# Altium schematic sheet 对射光电IC款UM8004-20260108.SchDoc
size 812 x 381 mm; SheetNumber: 0; SheetTotal: 0
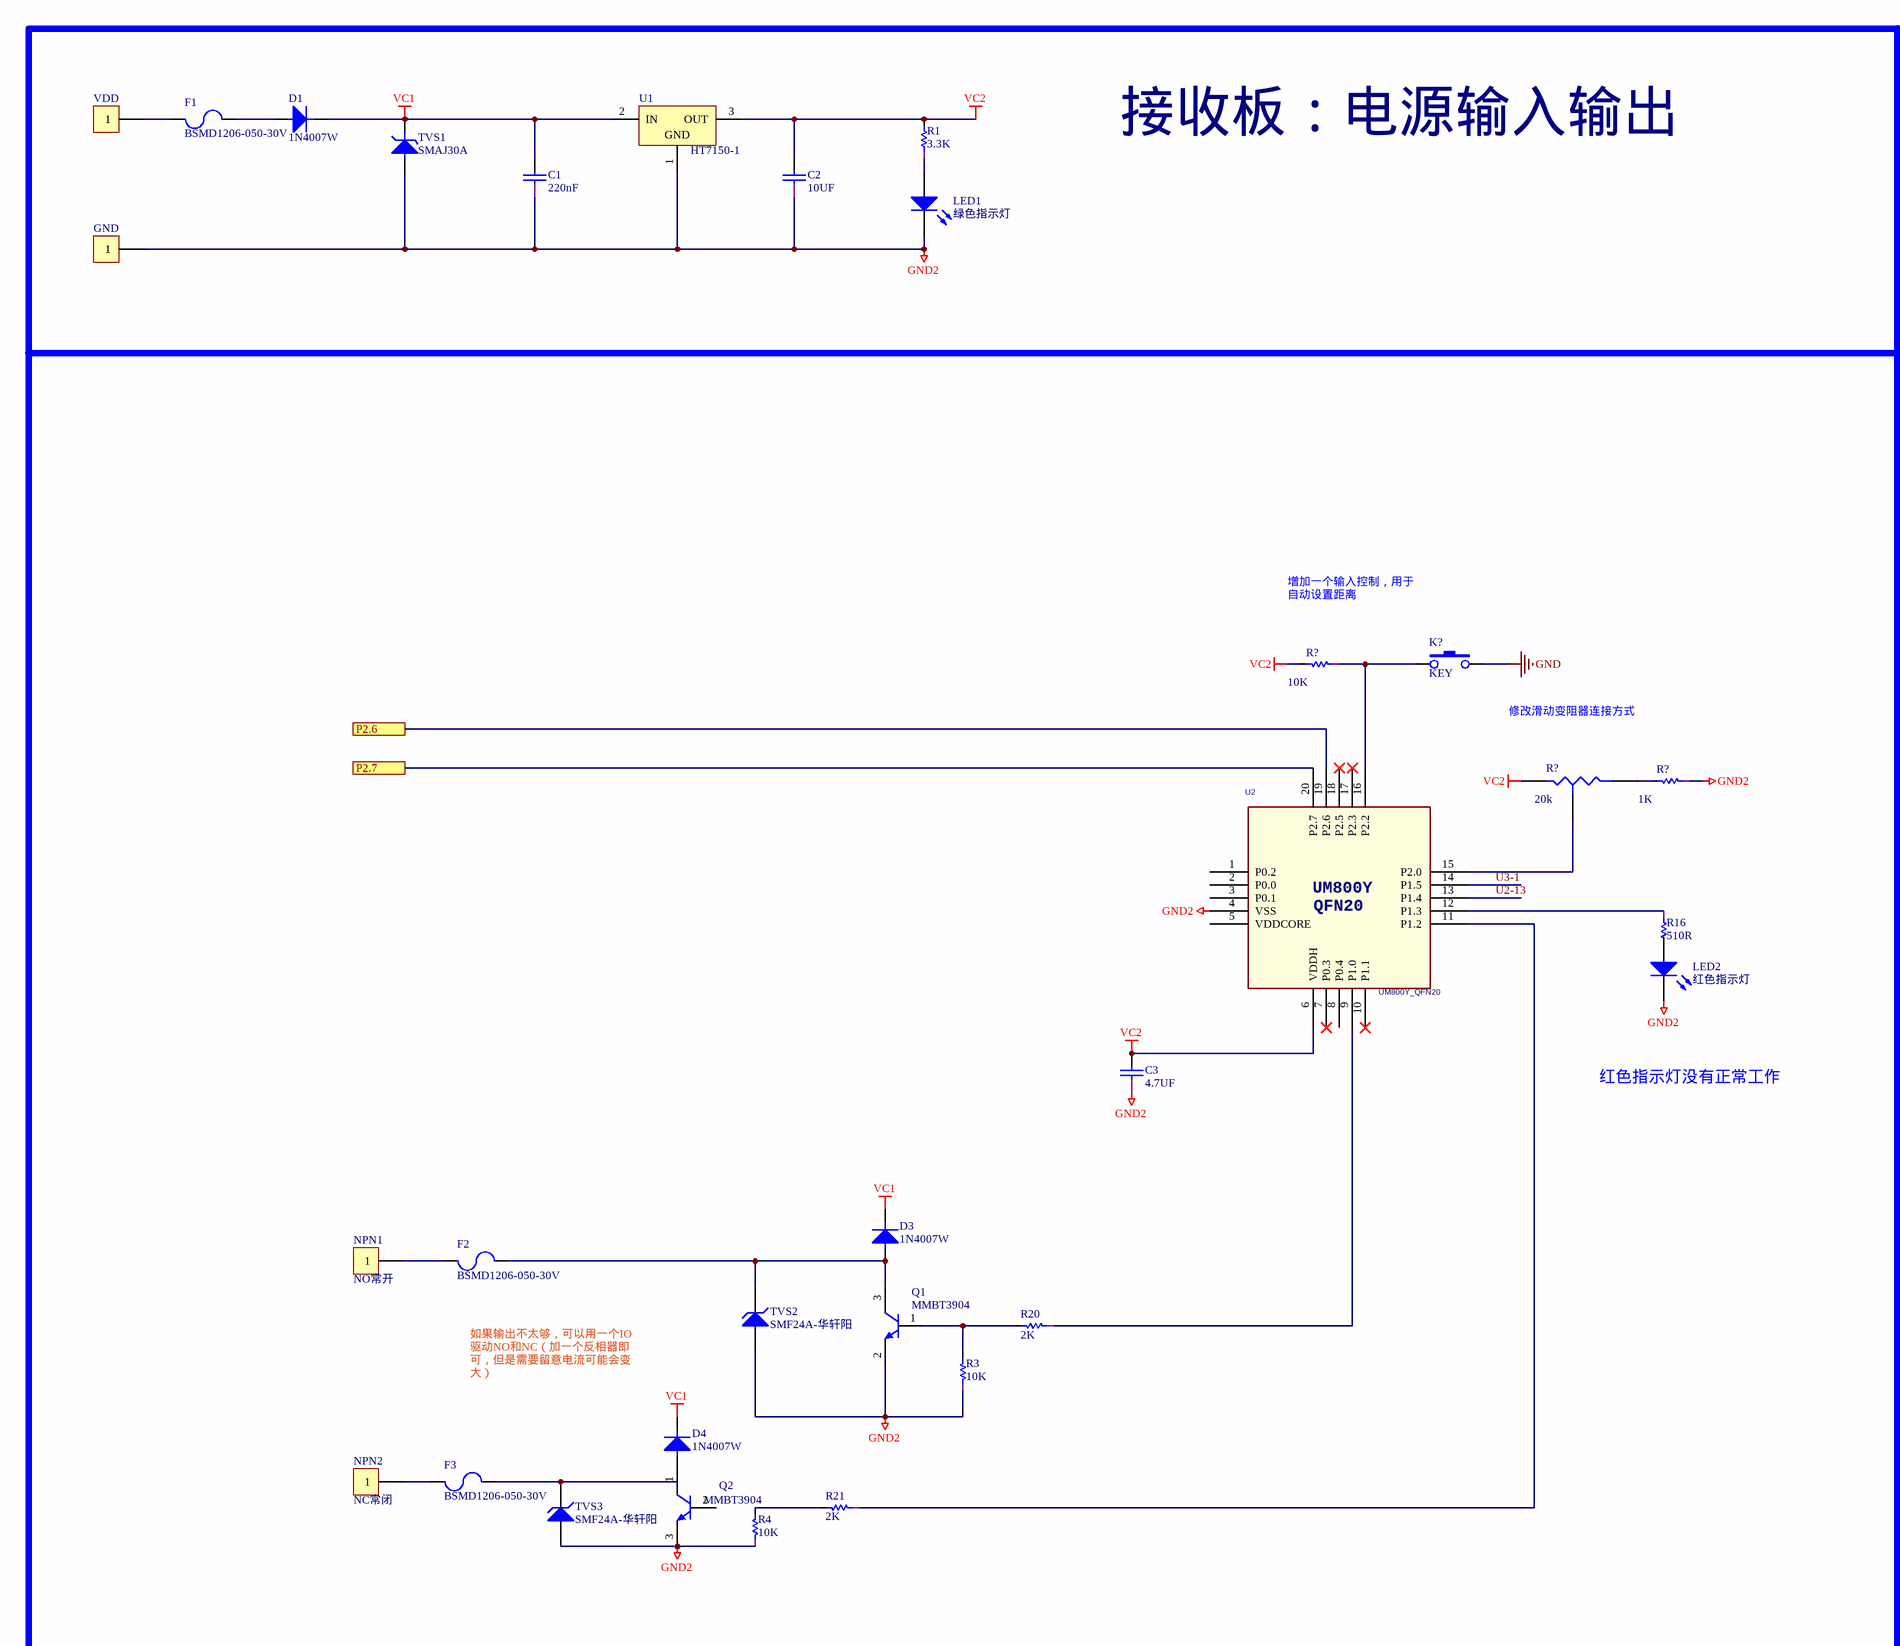
[diagram p0: 对射光电IC款UM8004-20260108.SchDoc, left]
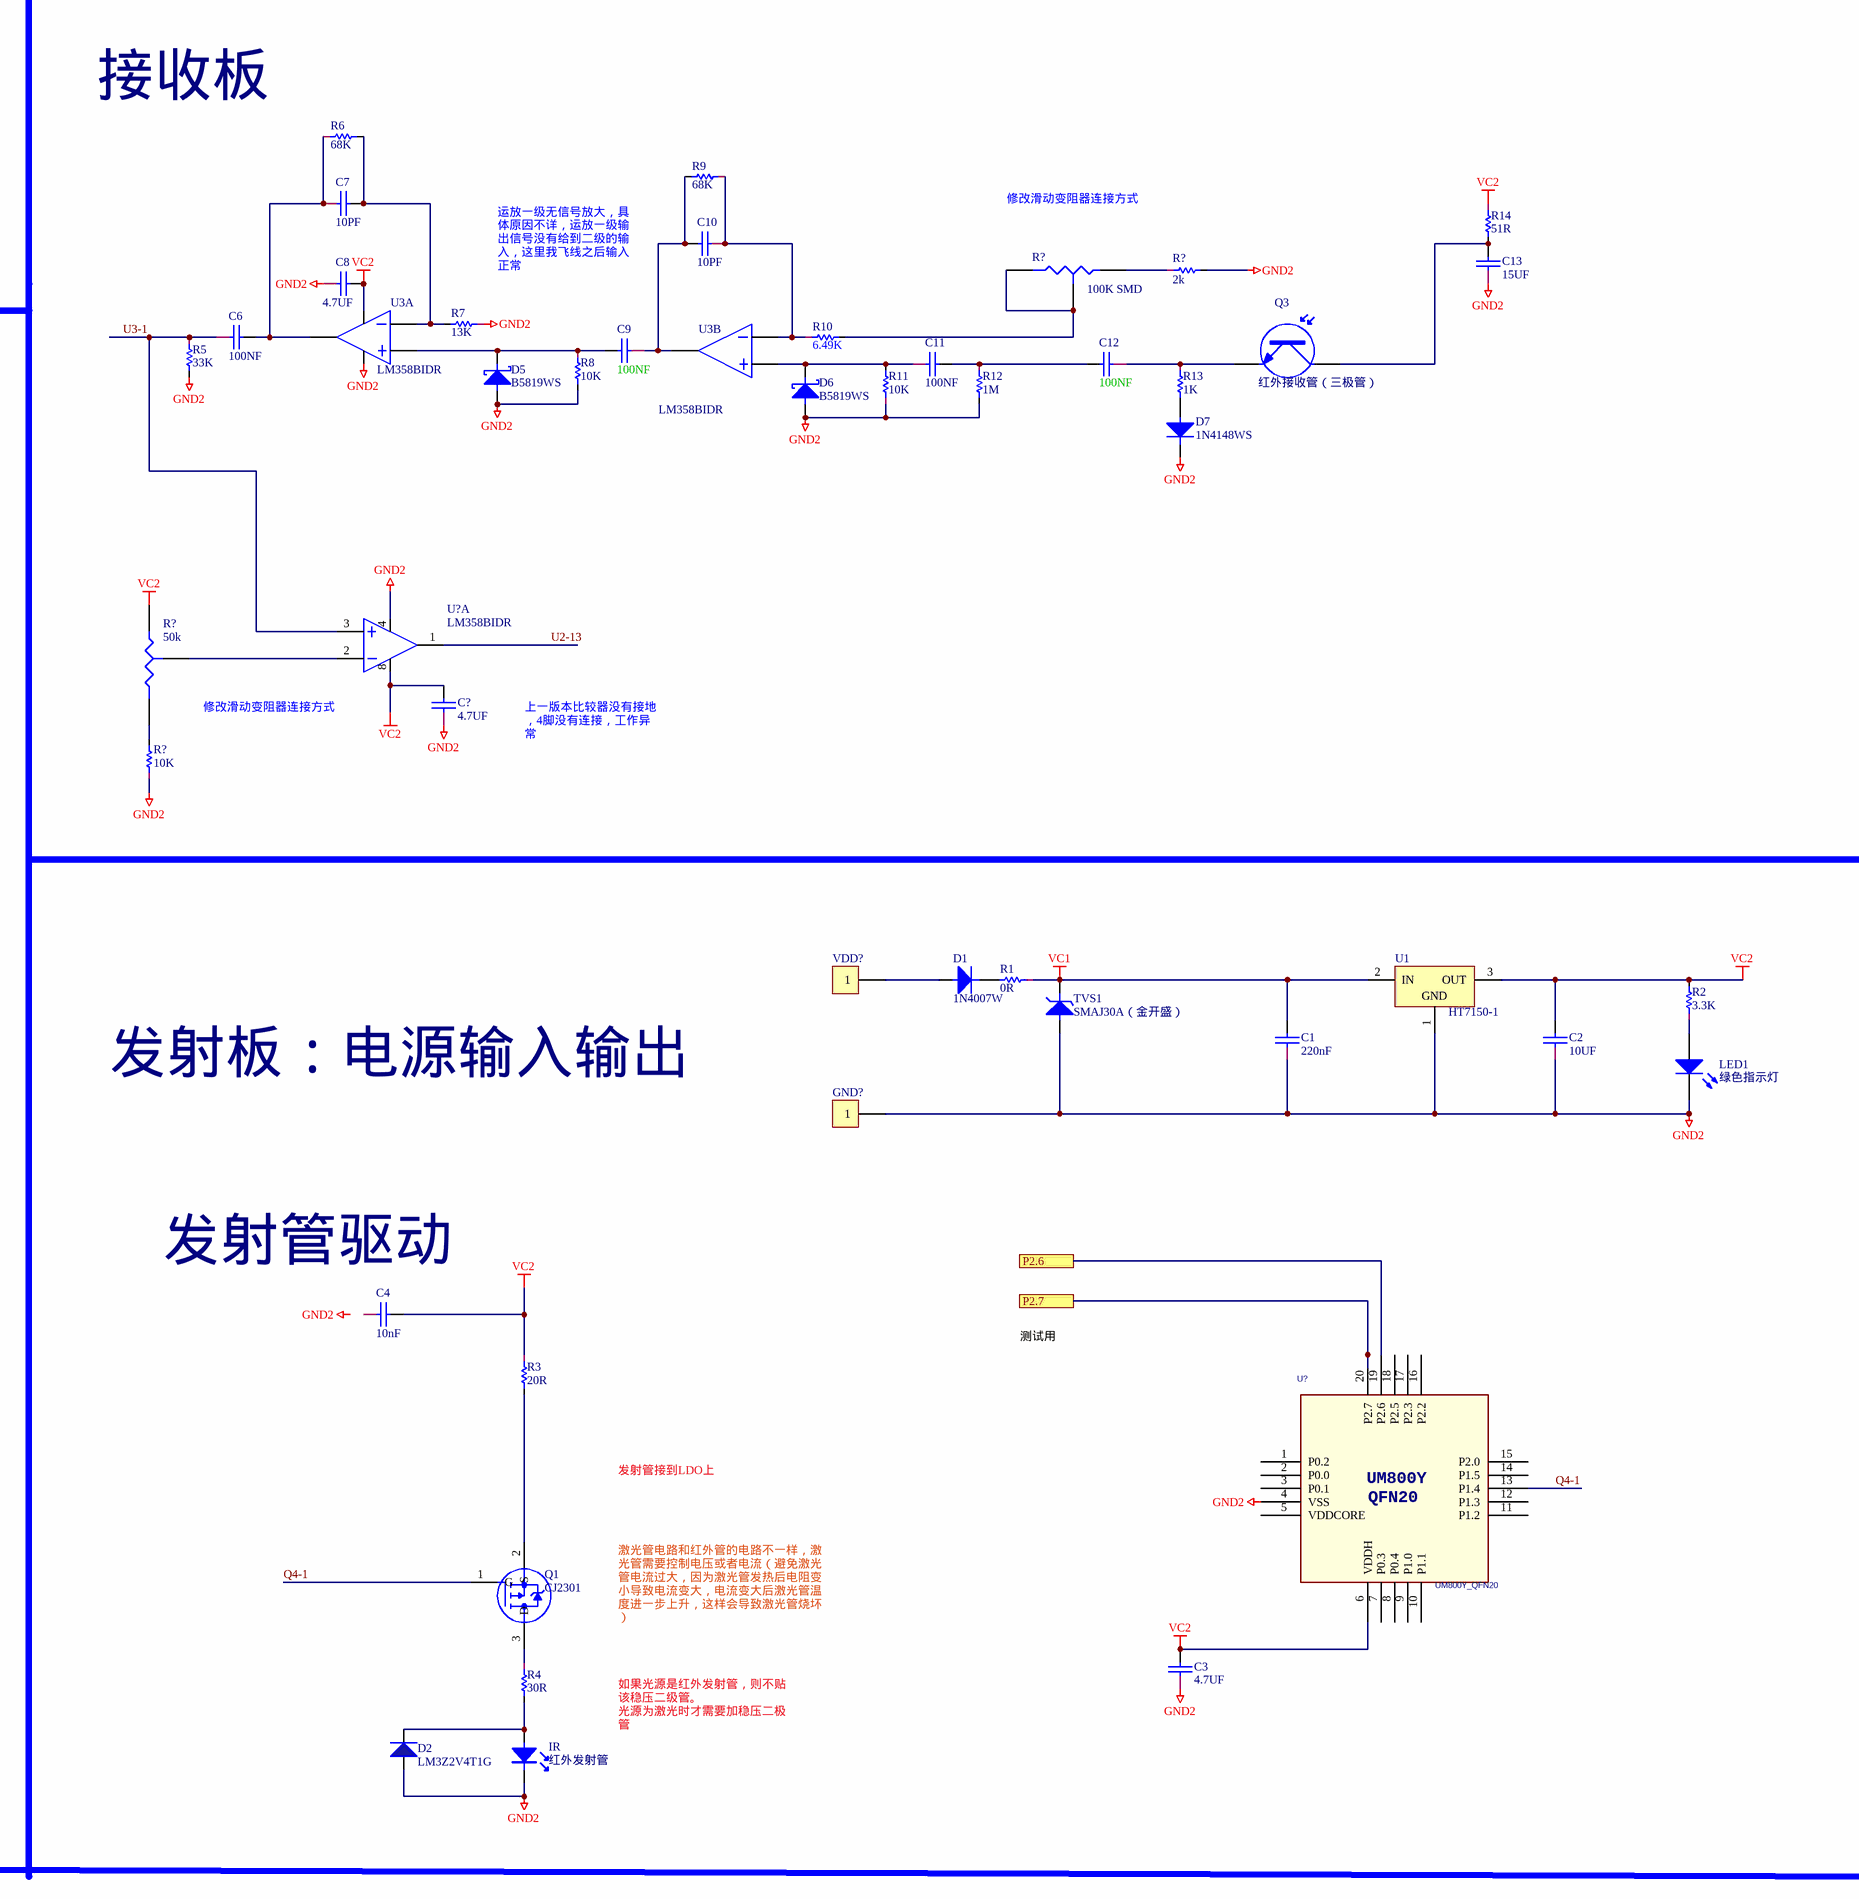
[diagram p1: 对射光电IC款UM8004-20260108.SchDoc, right]

## Parts
(Parts that share a designator on the sheet are numbered #1, #2 ... from top to bottom, then left to right.)
C1#1  220nF  [0603A]
C1#2  220nF  [0603A]
C2#1  10UF  [0603A]
C2#2  10UF  [0603A]
C3#1  4.7UF  [0603A]
C3#2  4.7UF  [0603A]
C4  10nF  [0603A]
C6  100NF  [0603A]
C7  10PF  [0603A]
C8  4.7UF  [0603A]
C9  100NF  [0603A]
C10  10PF  [0603A]
C11  100NF  [0603A]
C12  100NF  [0603A]
C13  15UF  [L]
C?  4.7UF  [0603A]
D1#1  1N4007W  [D1]
D1#2  1N4007W  [D1]
D2  LM3Z2V4T1G
D3  1N4007W  [D1]
D4  1N4007W  [D1]
D5  B5819WS  [D]
D6  B5819WS  [D]
D7  1N4148WS  [D]
F1  BSMD1206-050-30V  [1206]
F2  BSMD1206-050-30V  [1206]
F3  BSMD1206-050-30V  [1206]
GND  (no value)  [P]
GND?  (no value)  [P]
IR  红外发射管  [D4]
K?  KEY  [DIP-3X6X4.3]
LED1#1  绿色指示灯  [3.2X1.6X1.1]
LED1#2  绿色指示灯  [3.2X1.6X1.1]
LED2  红色指示灯  [3.2X1.6X1.1]
NPN1  NO常开  [P]
NPN2  NC常闭  [P]
Q1#1  MMBT3904  [TO-226-AA]
Q1#2  CJ2301  [SOP-3D]
Q2  MMBT3904  [TO-226-AA]
Q3  红外接收管（三极管）  [TO-220_A]
R1#1  3.3K  [0603]
R1#2  0R  [2512]
R2  3.3K  [0603]
R3#1  10K  [0603]
R3#2  20R  [0603]
R4#1  10K  [0603]
R4#2  30R  [0603]
R5  33K  [0603]
R6  68K  [0603]
R7  13K  [0603]
R8  10K  [0603]
R9  68K  [0603]
R10  6.49K  [0603]
R11  10K  [0603]
R12  1M  [0603]
R13  1K  [0603]
R14  51R  [1206]
R16  510R  [0603]
R20  2K  [0603]
R21  2K  [0603]
R?#1  value 100K SMD  [VR3]  (hidden comment: Res Tap)
R?#2  2k  [0603]
R?#3  value 50k  [VR3]  (hidden comment: Res Tap)
R?#4  10K  [0603]
R?#5  10K  [0603]
R?#6  value 20k  [VR3]  (hidden comment: Res Tap)
R?#7  1K  [0603]
TVS1#1  SMAJ30A  [D2]
TVS1#2  SMAJ30A（金开盛）  [D2]
TVS2  SMF24A-华轩阳  [GLZZ0002ZA-A]
TVS3  SMF24A-华轩阳  [GLZZ0002ZA-A]
U1#1  HT7150-1  [SOT89N]
U1#2  HT7150-1  [SOT89N]
U2  UM800Y_QFN20  [QFN20_300X300X55E40]
U3  LM358BIDR  [SOP-8]  (parts A,B of 2)
U?#1  LM358BIDR  [SOP-8]  (part A of 2)
U?#2  UM800Y_QFN20  [QFN20_300X300X55E40]
VDD  (no value)  [P]
VDD?  (no value)  [P]

## Ports
P2.6, P2.7

## Nets
GND: K?.3
GND2: C1#1.2 C1#2.2 C2#1.2 C2#2.2 C3#1.2 C3#2.2 C8.2 C13.2 C?.2 D2.1 D5.1 D6.1 D7.1(K) GND.1 GND?.1 IR.1 LED1#1.2(K) LED1#2.2(K) LED2.2(K) Q1#1.2(E) Q2.3(E) R3#1.2 R4#1.2 R5.1 R7.2 R8.1 R11.2 R12.1 R?#2.1 R?#5.2 R?#7.2 TVS1#1.1 TVS1#2.1 TVS2.2(A) TVS3.2(A) U1#1.1(GND) U1#2.1(GND) U2.4(VSS) U3.4 U?#1.4 U?#2.4(VSS)
VC1: C1#1.1 C1#2.1 D1#1.2(K) D3.2(K) D4.2(K) R1#2.2 TVS1#1.2 TVS1#2.2 U1#1.2(IN) U1#2.2(IN)
VC2: C2#1.1 C2#2.1 C3#1.1 C3#2.1 C4.1 C8.1 C?.1 R1#1.1 R2.1 R3#2.2 R14.2 R?#3.1(A) R?#4.1 R?#6.1(A) U1#1.3(OUT) U1#2.3(OUT) U2.6(VDDH) U3.8 U?#1.8 U?#2.6(VDDH)
P2.6: U2.19(P2.6) U?#2.19(P2.6) ; port P2.6
P2.7: U2.20(P2.7) U?#2.20(P2.7) ; port P2.7
Q4-1: Q1#2.1(G) U?#2.13(P1.4)
U2-13: U2.13(P1.4) U?#1.1
U3-1: C6.2 R5.2 U2.14(P1.5) U?#1.3
NetC6_1: C6.1 C7.2 R6.2 U3.1
NetC7_1: C7.1 R6.1 R7.1 U3.2
NetC9_1: C9.1 D5.2 R8.2 U3.3
NetC9_2: C9.2 C10.1 R9.1 U3.7
NetC10_2: C10.2 R9.2 R10.2 U3.6
NetC11_1: C11.1 C12.1 R12.2
NetC11_2: C11.2 D6.2 R11.1 U3.5
NetC12_2: C12.2 Q3.3(E) R13.2
NetC13_1: C13.1 Q3.1(C) R14.1
NetD1#1_1: D1#1.1(A) F1.1
NetD1#2_1: D1#2.1(A) VDD?.1
NetD1#2_2: D1#2.2(K) R1#2.1
NetD2_2: D2.2 IR.2 R4#2.1
NetD3_1: D3.1(A) F2.1 Q1#1.3(C) TVS2.1(K)
NetD4_1: D4.1(A) Q2.1(C)
NetD7_2: D7.2(A) R13.1
NetF1_2: F1.2 VDD.1
NetF2_2: F2.2 NPN1.1
NetF3_1: F3.1 TVS3.1(K)
NetF3_2: F3.2 NPN2.1
NetK?_1: K?.1 R?#4.2 U2.16(P2.2)
NetLED1#1_1: LED1#1.1(A) R1#1.2
NetLED1#2_1: LED1#2.1(A) R2.2
NetQ1#1_1: Q1#1.1(B) R3#1.1 R20.1
NetQ1#2_2: Q1#2.2(S) R3#2.1
NetQ1#2_3: Q1#2.3(D) R4#2.2
NetR4#1_1: R4#1.1 R21.1
NetR10_1: R10.1 R?#1.2(B) R?#1.3(TAP)
NetR16_2: R16.2 U2.12(P1.3)
NetR20_2: R20.2 U2.9(P1.0)
NetR21_2: R21.2 U2.11(P1.2)
NetR?#1_1: R?#1.1(A) R?#2.2
NetR?#3_2: R?#3.2(B) R?#5.1
NetR?#3_3: R?#3.3(TAP) U?#1.2
NetR?#6_2: R?#6.2(B) R?#7.1
NetR?#6_3: R?#6.3(TAP) U2.15(P2.0)

Not connected (* = marked no-connect by the designer): C4 2; LED2 1(A); Q2 2(B); R16 1; U2 1(P0.2) 2(P0.0) 3(P0.1) 5(VDDCORE) 7(P0.3)* 8(P0.4) 10(P1.1)* 17(P2.3)* 18(P2.5)*; U?#2 1(P0.2) 2(P0.0) 3(P0.1) 5(VDDCORE) 7(P0.3) 8(P0.4) 9(P1.0) 10(P1.1) 11(P1.2) 12(P1.3) 14(P1.5) 15(P2.0) 16(P2.2) 17(P2.3) 18(P2.5)

## Notes on the sheet
- 接收板：电源输入输出
- 接收板
- (near R?#1) 修改滑动变阻器连接方式
- 运放一级无信号放大，具体原因不详，运放一级输出信号没有给到二级的输入，这里我飞线之后输入正常
- 增加一个输入控制，用于自动设置距离
- (near R?#6) 修改滑动变阻器连接方式
- 修改滑动变阻器连接方式
- Type @ to refer to a designator or a net
- 上一版本比较器没有接地，4脚没有连接，工作异常
- 红色指示灯没有正常工作
- 发射板：电源输入输出
- 发射管驱动
- 如果输出不太够，可以用一个IO驱动NO和NC（加一个反相器即可，但是需要留意电流可能会变大）
- 测试用
- 发射管接到LDO上
- 激光管电路和红外管的电路不一样，激光管需要控制电压或者电流（避免激光管电流过大，因为激光管发热后电阻变小导致电流变大，电流变大后激光管温度进一步上升，这样会导致激光管烧坏）
- 如果光源是红外发射管，则不贴该稳压二级管。
  光源为激光时才需要加稳压二极管
- Labels drawn without touching a wire or pin: GND2
- (in symbol UM800Y_QFN20) UM800Y; QFN20

## Library data of the parts
C1#1 C1#2 C2#1 C2#2 C3#1 C3#2 C4 C6-C13 C? = CAP: Capacitor
D1#1 D1#2 D3 D4 = DIODE
D2 = D
D5 D6 = DIODE S: Schottky Diode
D7 = DIODEA: Diode
F1-F3 = FUSE
GND GND? NPN1 NPN2 VDD VDD? = CON1: Connector
IR = LEDA
LED1#1 LED1#2 LED2 = LED2: Typical RED, GREEN, YELLOW, AMBER GaAs LED; Published: 8-Jun-2000; LatestRevisionDate: 17-Jul-2002; LatestRevisionNote: Re-released for DXP Platform.; PackageVersion: Feb-2002; PackageReference: 3.2X1.6X1.1; Publisher: Altium Limited; PackageDescription: SM LED; 2 Flat Leads
Q1#1 Q2 = NPN: NPN Bipolar Transistor; Published: 8-Jun-2000; LatestRevisionDate: 17-Jul-2002; LatestRevisionNote: Re-released for DXP Platform.; PackageReference: TO-226-AA; Publisher: Altium Limited; PackageDescription: TO, Flat Index; 3 In-Line, Axial Leads; Body Dia. 4.8mm; Leads 0.55 x 0.51 mm (max); Code_JEDEC: TO-226-AA
Q1#2 = P-GSD
Q3 = Photo NPN: NPN Phototransistor; Published: 24-Mar-1999; LatestRevisionDate: 17-Jul-2002; LatestRevisionNote: Re-released for DXP Platform.; PackageReference: TO-220_A; Publisher: Altium Limited; Code_JEDEC: TO-220-AC
R1#1 R1#2 R2 R3#1 R3#2 R4#1 R4#2 R5-R14 R16 R20 R21 R?#2 R?#4 R?#5 R?#7 = RAS
R?#1 R?#3 R?#6 = Res Tap: Tapped Resistor; Sim Note: Enter the Resistance value and the set point into parameter fields.; Set Position: 0.5; Published: 24-Mar-1999; LatestRevisionDate: 17-Jul-2002; LatestRevisionNote: Re-released for DXP Platform.; PackageReference: VR3; Publisher: Altium Limited; PackageDescription: Variable Resistor, Thru-Hole; 3 Leads
TVS1#1 TVS1#2 = DIODE V: Varactor Diode
TVS2 TVS3 = HZK20: Silicon Epitaxial Planar Zener Diodes for Stabilized Power Supply; Published: 12-Feb-2010; DatasheetVersion: Rev.3.00, May-2003; PackageVersion: Aug-2005; PackageReference: GLZZ0002ZA-A; Publisher: Altium Limited; PackageDescription: Metal Electrode Face (MELF) Diode; Body 3.5 x 1.35 mm (LxDia); ComponentLink1Description: Manufacturer Link; ComponentLink1URL: http://sg.renesas.com/fmwk.jsp?cnt=diode_landing.jsp&fp=/products/discrete/diodes/; ComponentLink2Description: Datasheet; ComponentLink2URL: http://documentation.renesas.com/eng/products/diode/rej03g0018_hzk.pdf; ComponentLink3Description: Packaging Specification; ComponentLink3URL: http://sg.renesas.com/media/products/common_info/package/pdf/diode/code/glzz0002za_a.pdf
U1#1 U1#2 = HT7530-1: 3.0V 100mA Low Power,  Low Dropout Voltage (LDO) Regulator; Published: 30-Mar-2007; DatasheetVersion: rev1.50, Jan-2006; PackageVersion: Jan-2006; PackageReference: SOT-89; Publisher: Altium Limited; PackageDescription: 3-Pin SOT-89 Package 1.5 mm Pitch, 4.1 mm Lead Span; Code_IPC: SOT89; ComponentLink1Description: Manufacturer Link; ComponentLink1URL: http://www.holtek.com/; ComponentLink2Description: Datasheet; ComponentLink2URL: http://www.holtek.com/pdf/consumer/75xx_1v150.pdf
U3 U?#1 = LM358